# Altium schematic sheet MCU.SchDoc
size A3; SheetNumber: 3; SheetTotal: 9
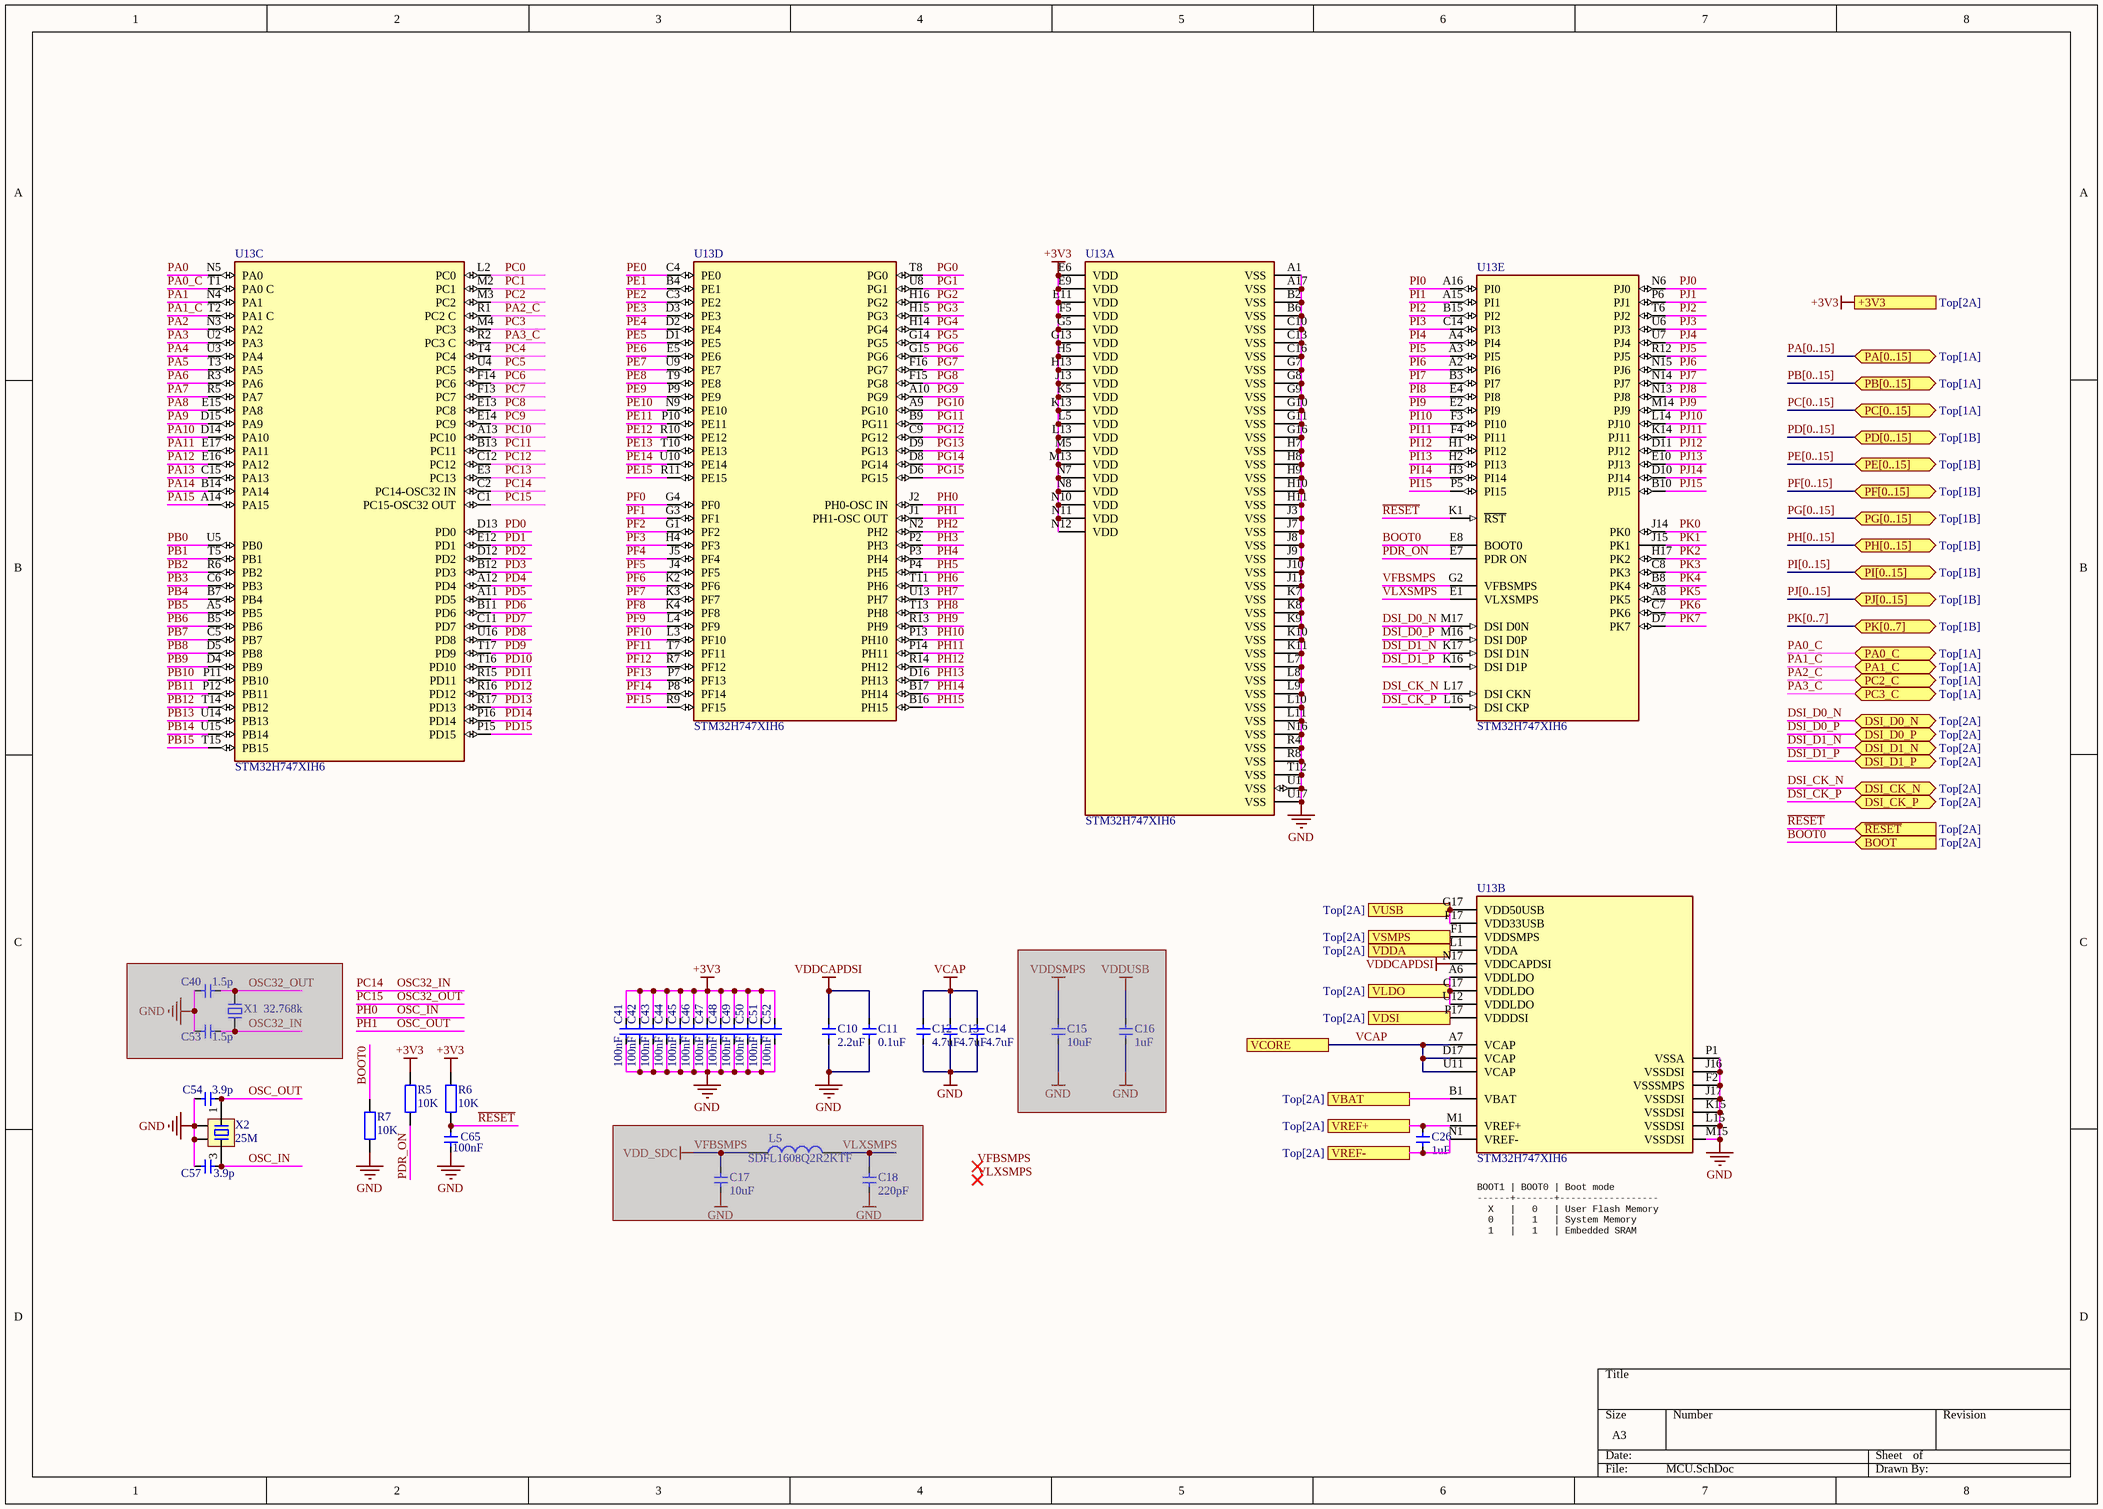
[diagram p0: MCU.SchDoc]

## Parts
C10  2.2uF  [0402-C]
C11  0.1uF  [0402-C]
C12  4.7uF  [0402-C]
C13  4.7uF  [0402-C]
C14  4.7uF  [0402-C]
C15  10uF  [0402-C]  (masked out: inside a compile mask, not in the netlist)
C16  1uF  [0402-C]  (masked out: inside a compile mask, not in the netlist)
C17  10uF  [0402-C]  (masked out: inside a compile mask, not in the netlist)
C18  220pF  [0402-C]  (masked out: inside a compile mask, not in the netlist)
C26  1uF  [0402-C]
C40  1.5p  [0402-C]  (masked out: inside a compile mask, not in the netlist)
C41  100nF  [0402-C]
C42  100nF  [0402-C]
C43  100nF  [0402-C]
C44  100nF  [0402-C]
C45  100nF  [0402-C]
C46  100nF  [0402-C]
C47  100nF  [0402-C]
C48  100nF  [0402-C]
C49  100nF  [0402-C]
C50  100nF  [0402-C]
C51  100nF  [0402-C]
C52  100nF  [0402-C]
C53  1.5p  [0402-C]  (masked out: inside a compile mask, not in the netlist)
C54  3.9p  [0402-C]
C57  3.9p  [0402-C]
C65  100nF  [0402-C]
L5  SDFL1608Q2R2KTF  [L0805]  (masked out: inside a compile mask, not in the netlist)
R5  10K  [0402-R]
R6  10K  [0402-R]
R7  10K  [0402-R]
U13  STM32H747XIH6  [FP-TFBGA240+25-A07U-MFG]  (parts A,B,C,D,E of 5)
X1  32.768k  [XTAL-3215-2P]  (masked out: inside a compile mask, not in the netlist)
X2  25M  [XTAL-3225-4P]

## Ports
+3V3 (see Top[2A]), BOOT (in, see Top[2A]), DSI_CK_N (bidir, see Top[2A]), DSI_CK_P (bidir, see Top[2A]), DSI_D0_N (bidir, see Top[2A]), DSI_D0_P (bidir, see Top[2A]), DSI_D1_N (bidir, see Top[2A]), DSI_D1_P (bidir, see Top[2A]), PA0_C (bidir, see Top[1A]), PA1_C (bidir, see Top[1A]), PA[0..15] (bidir, see Top[1A]), PB[0..15] (bidir, see Top[1A]), PC2_C (bidir, see Top[1A]), PC3_C (bidir, see Top[1A]), PC[0..15] (bidir, see Top[1A]), PD[0..15] (bidir, see Top[1B]), PE[0..15] (bidir, see Top[1B]), PF[0..15] (bidir, see Top[1B]), PG[0..15] (bidir, see Top[1B]), PH[0..15] (bidir, see Top[1B]), PI[0..15] (bidir, see Top[1B]), PJ[0..15] (bidir, see Top[1B]), PK[0..7] (bidir, see Top[1B]), VBAT (see Top[2A]), VCORE, VDDA (see Top[2A]), VDSI (see Top[2A]), VLDO (see Top[2A]), VREF+ (see Top[2A]), VREF- (see Top[2A]), VSMPS (see Top[2A]), VUSB (see Top[2A]), ~{RESET} (in, see Top[2A])

## Nets
+3V3: C41.1 C42.1 C43.1 C44.1 C45.1 C46.1 C47.1 C48.1 C49.1 C50.1 C51.1 C52.1 R5.2 R6.2 U13.E6(VDD) U13.E9(VDD) U13.E11(VDD) U13.F5(VDD) U13.G5(VDD) U13.G13(VDD) U13.H5(VDD) U13.H13(VDD) U13.J13(VDD) U13.K5(VDD) U13.K13(VDD) U13.L5(VDD) U13.L13(VDD) U13.M5(VDD) U13.M13(VDD) U13.N7(VDD) U13.N8(VDD) U13.N10(VDD) U13.N11(VDD) U13.N12(VDD) ; port +3V3
GND: C10.1 C11.1 C12.1 C13.1 C14.1 C41.2 C42.2 C43.2 C44.2 C45.2 C46.2 C47.2 C48.2 C49.2 C50.2 C51.2 C52.2 C54.2 C57.2 C65.2 R7.1 U13.A1(VSS) U13.A17(VSS) U13.B2(VSS) U13.B6(VSS) U13.C10(VSS) U13.C13(VSS) U13.C16(VSS) U13.F2(VSSSMPS) U13.G7(VSS) U13.G8(VSS) U13.G9(VSS) U13.G10(VSS) U13.G11(VSS) U13.G16(VSS) U13.H7(VSS) U13.H8(VSS) U13.H9(VSS) U13.H10(VSS) U13.H11(VSS) U13.J3(VSS) U13.J7(VSS) U13.J8(VSS) U13.J9(VSS) U13.J10(VSS) U13.J11(VSS) U13.J16(VSSDSI) U13.J17(VSSDSI) U13.K7(VSS) U13.K8(VSS) U13.K9(VSS) U13.K10(VSS) U13.K11(VSS) U13.K15(VSSDSI) U13.L7(VSS) U13.L8(VSS) U13.L9(VSS) U13.L10(VSS) U13.L11(VSS) U13.L15(VSSDSI) U13.M15(VSSDSI) U13.N16(VSS) U13.P1(VSSA) U13.R4(VSS) U13.R8(VSS) U13.T12(VSS) U13.U1(VSS) U13.U17(VSS) X2.2 X2.4
VCAP: C12.2 C13.2 C14.2 U13.A7(VCAP) U13.D17(VCAP) U13.U11(VCAP) ; port VCORE
VDDCAPDSI: C10.2 C11.2 U13.N17(VDDCAPDSI)
BOOT0: R7.2 U13.E8(BOOT0) ; port BOOT
DSI_CK_N: U13.L17(DSI_CKN) ; port DSI_CK_N
DSI_CK_P: U13.L16(DSI_CKP) ; port DSI_CK_P
DSI_D0_N: U13.M17(DSI_D0N) ; port DSI_D0_N
DSI_D0_P: U13.M16(DSI_D0P) ; port DSI_D0_P
DSI_D1_N: U13.K17(DSI_D1N) ; port DSI_D1_N
DSI_D1_P: U13.K16(DSI_D1P) ; port DSI_D1_P
OSC32_IN: U13.C2(PC14-OSC32_IN)  [also labelled PC14]
OSC32_OUT: U13.C1(PC15-OSC32_OUT)  [also labelled PC15]
OSC_IN: C57.1 U13.J2(PH0-OSC_IN) X2.3  [also labelled PH0]
OSC_OUT: C54.1 U13.J1(PH1-OSC_OUT) X2.1  [also labelled PH1]
PA0: U13.N5(PA0)
PA0_C: U13.T1(PA0_C) ; port PA0_C
PA1: U13.N4(PA1)
PA1_C: U13.T2(PA1_C) ; port PA1_C
PA2: U13.N3(PA2)
PA2_C: U13.R1(PC2_C) ; port PC2_C
PA3: U13.U2(PA3)
PA3_C: U13.R2(PC3_C) ; port PC3_C
PA4: U13.U3(PA4)
PA5: U13.T3(PA5)
PA6: U13.R3(PA6)
PA7: U13.R5(PA7)
PA8: U13.E15(PA8)
PA9: U13.D15(PA9)
PA10: U13.D14(PA10)
PA11: U13.E17(PA11)
PA12: U13.E16(PA12)
PA13: U13.C15(PA13)
PA14: U13.B14(PA14)
PA15: U13.A14(PA15)
PB0: U13.U5(PB0)
PB1: U13.T5(PB1)
PB2: U13.R6(PB2)
PB3: U13.C6(PB3)
PB4: U13.B7(PB4)
PB5: U13.A5(PB5)
PB6: U13.B5(PB6)
PB7: U13.C5(PB7)
PB8: U13.D5(PB8)
PB9: U13.D4(PB9)
PB10: U13.P11(PB10)
PB11: U13.P12(PB11)
PB12: U13.T14(PB12)
PB13: U13.U14(PB13)
PB14: U13.U15(PB14)
PB15: U13.T15(PB15)
PC0: U13.L2(PC0)
PC1: U13.M2(PC1)
PC2: U13.M3(PC2)
PC3: U13.M4(PC3)
PC4: U13.T4(PC4)
PC5: U13.U4(PC5)
PC6: U13.F14(PC6)
PC7: U13.F13(PC7)
PC8: U13.E13(PC8)
PC9: U13.E14(PC9)
PC10: U13.A13(PC10)
PC11: U13.B13(PC11)
PC12: U13.C12(PC12)
PC13: U13.E3(PC13)
PD0: U13.D13(PD0)
PD1: U13.E12(PD1)
PD2: U13.D12(PD2)
PD3: U13.B12(PD3)
PD4: U13.A12(PD4)
PD5: U13.A11(PD5)
PD6: U13.B11(PD6)
PD7: U13.C11(PD7)
PD8: U13.U16(PD8)
PD9: U13.T17(PD9)
PD10: U13.T16(PD10)
PD11: U13.R15(PD11)
PD12: U13.R16(PD12)
PD13: U13.R17(PD13)
PD14: U13.P16(PD14)
PD15: U13.P15(PD15)
PDR_ON: R5.1 U13.E7(PDR_ON)
PE0: U13.C4(PE0)
PE1: U13.B4(PE1)
PE2: U13.C3(PE2)
PE3: U13.D3(PE3)
PE4: U13.D2(PE4)
PE5: U13.D1(PE5)
PE6: U13.E5(PE6)
PE7: U13.U9(PE7)
PE8: U13.T9(PE8)
PE9: U13.P9(PE9)
PE10: U13.N9(PE10)
PE11: U13.P10(PE11)
PE12: U13.R10(PE12)
PE13: U13.T10(PE13)
PE14: U13.U10(PE14)
PE15: U13.R11(PE15)
PF0: U13.G4(PF0)
PF1: U13.G3(PF1)
PF2: U13.G1(PF2)
PF3: U13.H4(PF3)
PF4: U13.J5(PF4)
PF5: U13.J4(PF5)
PF6: U13.K2(PF6)
PF7: U13.K3(PF7)
PF8: U13.K4(PF8)
PF9: U13.L4(PF9)
PF10: U13.L3(PF10)
PF11: U13.T7(PF11)
PF12: U13.R7(PF12)
PF13: U13.P7(PF13)
PF14: U13.P8(PF14)
PF15: U13.R9(PF15)
PG0: U13.T8(PG0)
PG1: U13.U8(PG1)
PG2: U13.H16(PG2)
PG3: U13.H15(PG3)
PG4: U13.H14(PG4)
PG5: U13.G14(PG5)
PG6: U13.G15(PG6)
PG7: U13.F16(PG7)
PG8: U13.F15(PG8)
PG9: U13.A10(PG9)
PG10: U13.A9(PG10)
PG11: U13.B9(PG11)
PG12: U13.C9(PG12)
PG13: U13.D9(PG13)
PG14: U13.D8(PG14)
PG15: U13.D6(PG15)
PH2: U13.N2(PH2)
PH3: U13.P2(PH3)
PH4: U13.P3(PH4)
PH5: U13.P4(PH5)
PH6: U13.T11(PH6)
PH7: U13.U13(PH7)
PH8: U13.T13(PH8)
PH9: U13.R13(PH9)
PH10: U13.P13(PH10)
PH11: U13.P14(PH11)
PH12: U13.R14(PH12)
PH13: U13.D16(PH13)
PH14: U13.B17(PH14)
PH15: U13.B16(PH15)
PI0: U13.A16(PI0)
PI1: U13.A15(PI1)
PI2: U13.B15(PI2)
PI3: U13.C14(PI3)
PI4: U13.A4(PI4)
PI5: U13.A3(PI5)
PI6: U13.A2(PI6)
PI7: U13.B3(PI7)
PI8: U13.E4(PI8)
PI9: U13.E2(PI9)
PI10: U13.F3(PI10)
PI11: U13.F4(PI11)
PI12: U13.H1(PI12)
PI13: U13.H2(PI13)
PI14: U13.H3(PI14)
PI15: U13.P5(PI15)
PJ0: U13.N6(PJ0)
PJ1: U13.P6(PJ1)
PJ2: U13.T6(PJ2)
PJ3: U13.U6(PJ3)
PJ4: U13.U7(PJ4)
PJ5: U13.R12(PJ5)
PJ6: U13.N15(PJ6)
PJ7: U13.N14(PJ7)
PJ8: U13.N13(PJ8)
PJ9: U13.M14(PJ9)
PJ10: U13.L14(PJ10)
PJ11: U13.K14(PJ11)
PJ12: U13.D11(PJ12)
PJ13: U13.E10(PJ13)
PJ14: U13.D10(PJ14)
PJ15: U13.B10(PJ15)
PK0: U13.J14(PK0)
PK1: U13.J15(PK1)
PK2: U13.H17(PK2)
PK3: U13.C8(PK3)
PK4: U13.B8(PK4)
PK5: U13.A8(PK5)
PK6: U13.C7(PK6)
PK7: U13.D7(PK7)
~{RESET}: C65.1 R6.1 U13.K1(~{RST}) ; port ~{RESET}
VBAT: U13.B1(VBAT) ; port VBAT
VDDA: U13.L1(VDDA) ; port VDDA
VDSI: U13.P17(VDDDSI) ; port VDSI
VFBSMPS: U13.G2(VFBSMPS)
VLDO: U13.A6(VDDLDO) U13.C17(VDDLDO) U13.U12(VDDLDO) ; port VLDO
VLXSMPS: U13.E1(VLXSMPS)
VREF+: C26.2 U13.M1(VREF+) ; port VREF+
VREF-: C26.1 U13.N1(VREF-) ; port VREF-
VSMPS: U13.F1(VDDSMPS) ; port VSMPS
VUSB: U13.F17(VDD33USB) U13.G17(VDD50USB) ; port VUSB

## Buses and harness runs
bus PA[0..15] = port PA[0..15]
bus PB[0..15] = port PB[0..15]
bus PC[0..15] = port PC[0..15]
bus PD[0..15] = port PD[0..15]
bus PE[0..15] = port PE[0..15]
bus PF[0..15] = port PF[0..15]
bus PG[0..15] = port PG[0..15]
bus PH[0..15] = port PH[0..15]
bus PI[0..15] = port PI[0..15]
bus PJ[0..15] = port PJ[0..15]
bus PK[0..7] = port PK[0..7]

## Notes on the sheet
- Ceramic capacitor (Low ESR <600m ohm)
- BOOT1 | BOOT0 | Boot mode
  ------+-------+------------------
  X   |   0   | User Flash Memory
  0   |   1   | System Memory
  1   |   1   | Embedded SRAM
- Labels drawn without touching a wire or pin: VFBSMPS, VLXSMPS

## Library data of the parts
C10-C18 C26 C40-C54 C57 C65 = 电容-0402: Capacitor; Value: 0.1u
L5 = L: 贴片小功率电感; BOM名称: 小功率贴片电感; 联系下单店铺卖家 免费帮你查找封装: 联系下单店铺卖家 免费技术支持
R5-R7 = R: 贴片电阻; 联系卖家，免费查找封装: 唯一出售店铺网址https://shop463601444.taobao.com; BOM名称: 贴片电阻
U13 = CMP-12105-000055-1: HIGH-PERFORMANCE AND DSP WITH DP; Manufacturer: STMicroelectronics; Number Of Uart Channels: 9; Number Of Pwm Channels: 2; Memory Size: 2MBytes; Number Of Ethernet Channels: 1; Ram Size: 1MBytes; Number Of Timers/Counters: 22; Data Bus Width: 32bits; Core Architecture: ARM Cortex-M4, ARM Cortex-M7; Interface: I2C,SPI,UART,USART,CAN,USB,LIN,IrDA,Ethernet,I2S,SMBus,Other; Number Of Adc Channels: 36; Min Supply Voltage: 1.2V; Number Of A/D Converters: 3; Number Of Spi Channels: 6; Max Supply Voltage: 3.6V; Frequency: 480MHz; Memory Type: FLASH; Number Of I2C Channels: 4; Max Junction Temp: +125°C; Standoff Height: 0.15mm; Number Of I/Os: 168; Device Class L2: Embedded Processors and Controllers; Digikey Description: HIGH-PERFORMANCE AND DSP WITH DP; RoHS: TRUE; Lead Free: Yes; Manufacturer Part Number: STM32H747XIH6; ComponentLink2URL: https://www.st.com/resource/en/datasheet/stm32h747xi.pdf; Mouser Description: STM32 Series 2 MB Flash 1 MB RAM 480 MHz 32-Bit Microcontroller - TFBGA-265; Device Class L1: Integrated Circuits (ICs); Ipc Land Pattern Name: BGA289N80P17X17_1400X1400X110; Category: IC; Device Class L3: Microcontrollers; Ambient Temperature Range High: +85°C; Number Of Cores: 2; Temperature Range High: +125°C; ComponentLink2Description: Datasheet; Automotive: No; Ambient Temperature Range Low: -40°C; Package: TFBGA240+25-A07U; Temperature: -40°C to +125°C; Number Of Usb Channels: 2; Temperature Range Low: -40°C; Height: 1.1mm; Octopart: https://octopart.com/stm32h747xih6-stmicroelectronics-100293943
X1 = XTAL-2P: 2脚无源晶振(谐振器）; 联系下单店铺卖家 免费帮你查找封装: 联系下单店铺卖家 免费技术支持; BOM名称: 2脚无源晶振(谐振器）
X2 = XTAL-4P: 4脚无源晶振(谐振器）; 联系下单店铺卖家 免费帮你查找封装: 联系下单店铺卖家 免费技术支持; BOM名称: 4脚无源晶振(谐振器）